# EAGLE design ARE_entrenadora_3 (EAGLE 5.10)
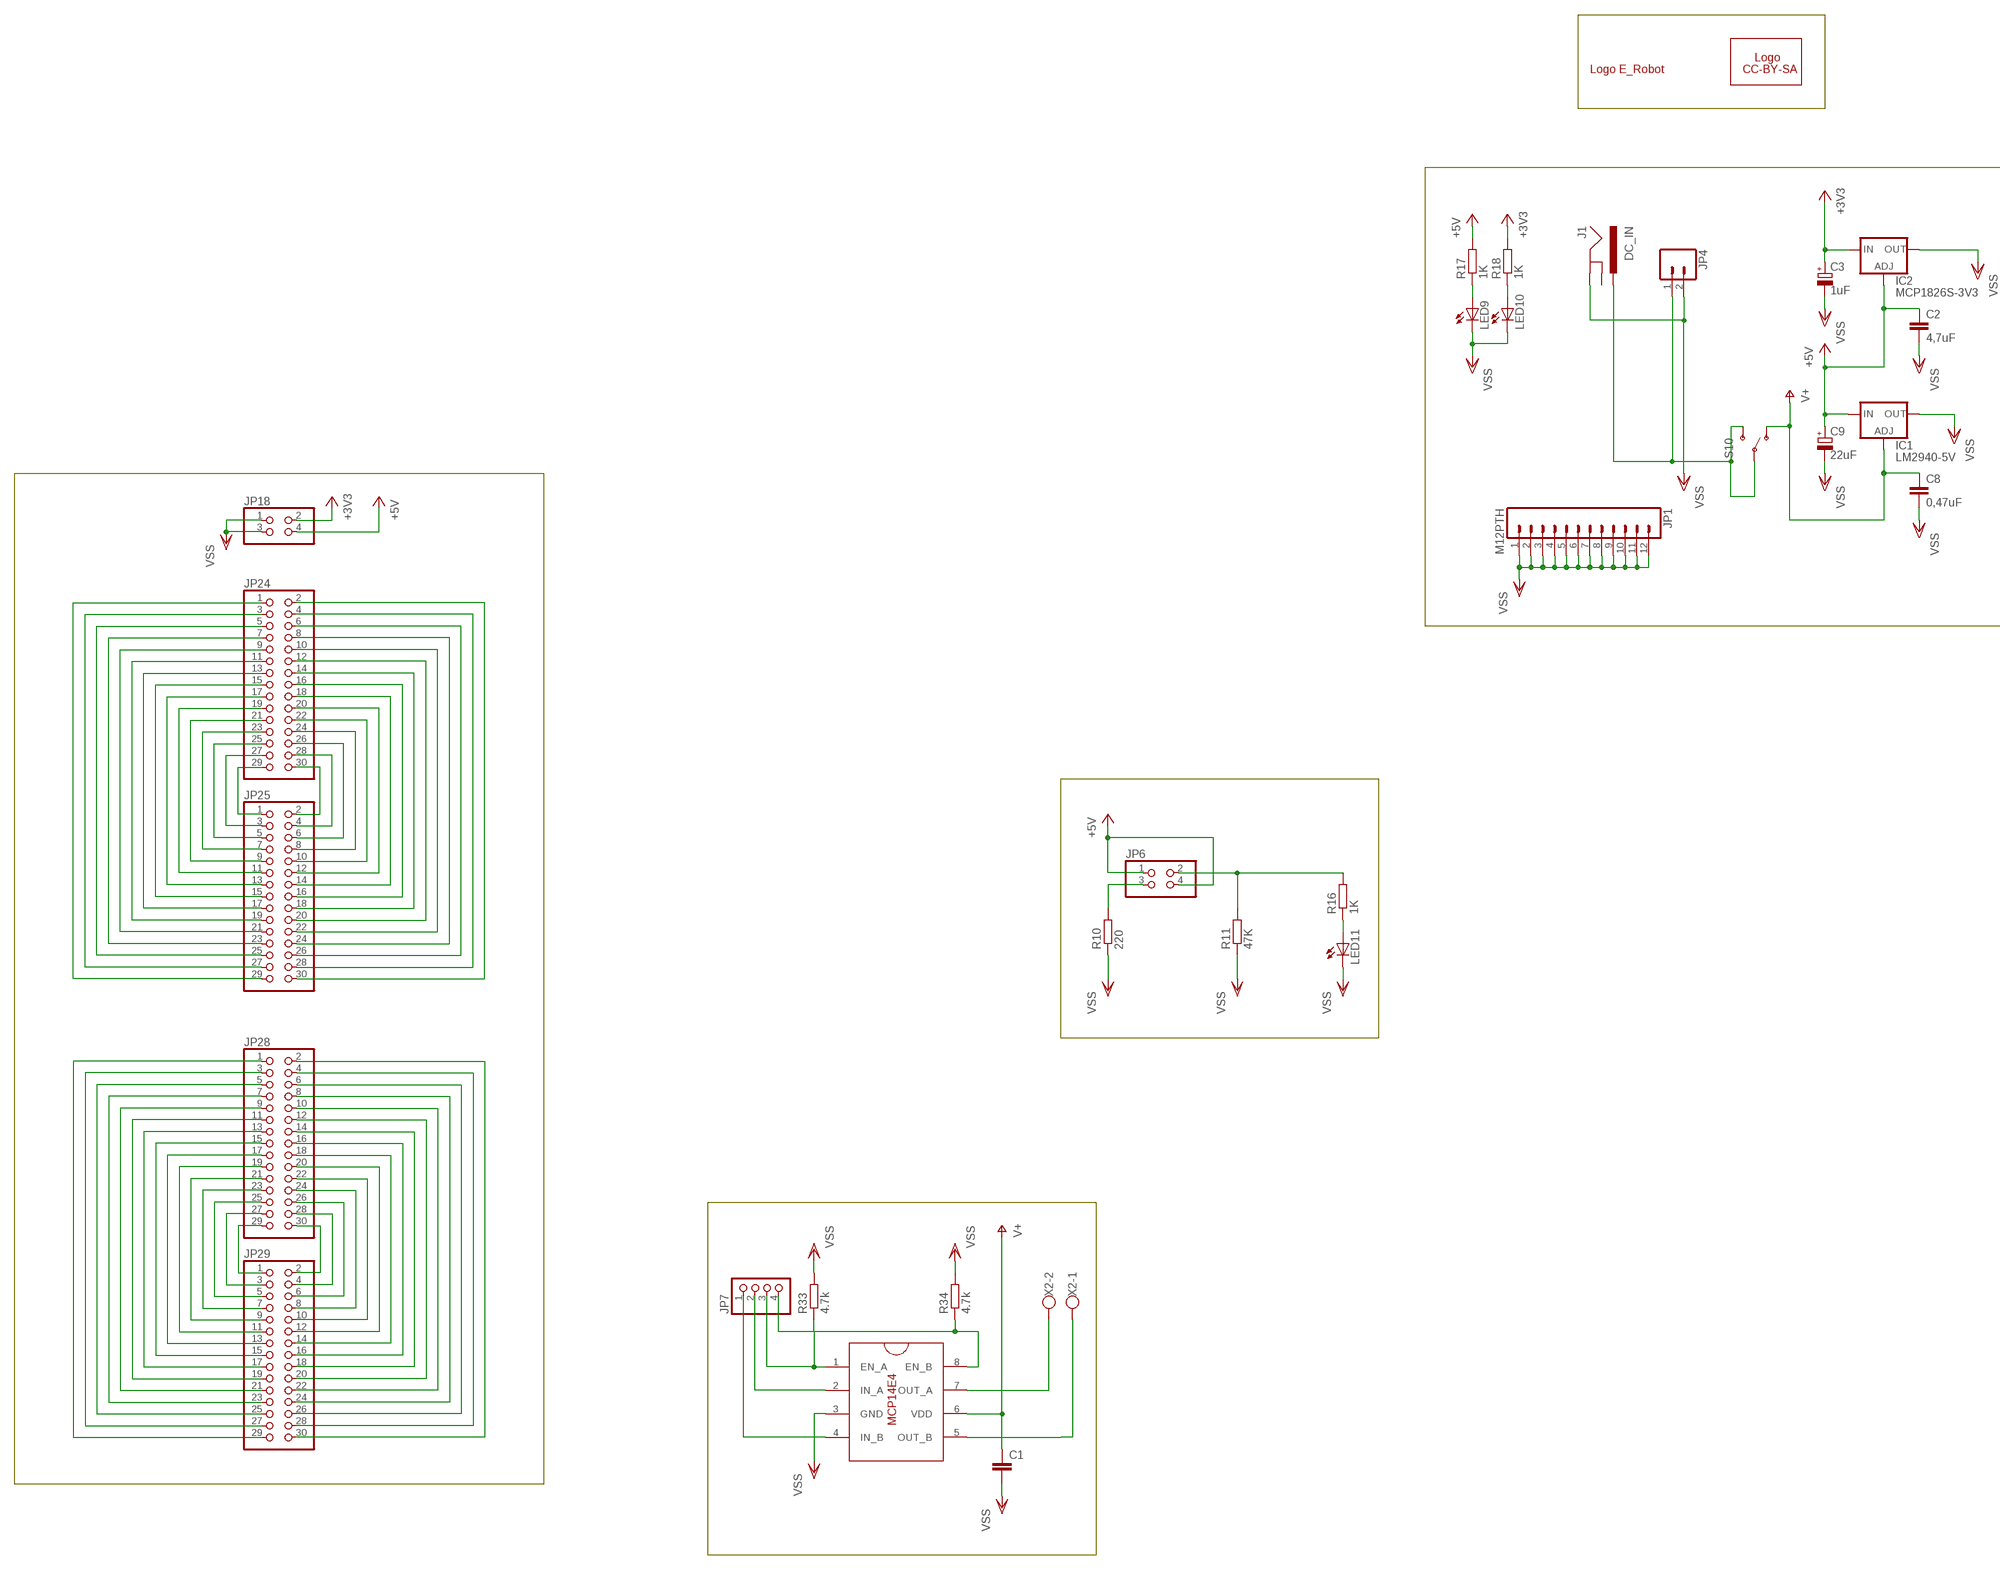
[diagram p0: schematic, sheet 1, part 1 of 2]
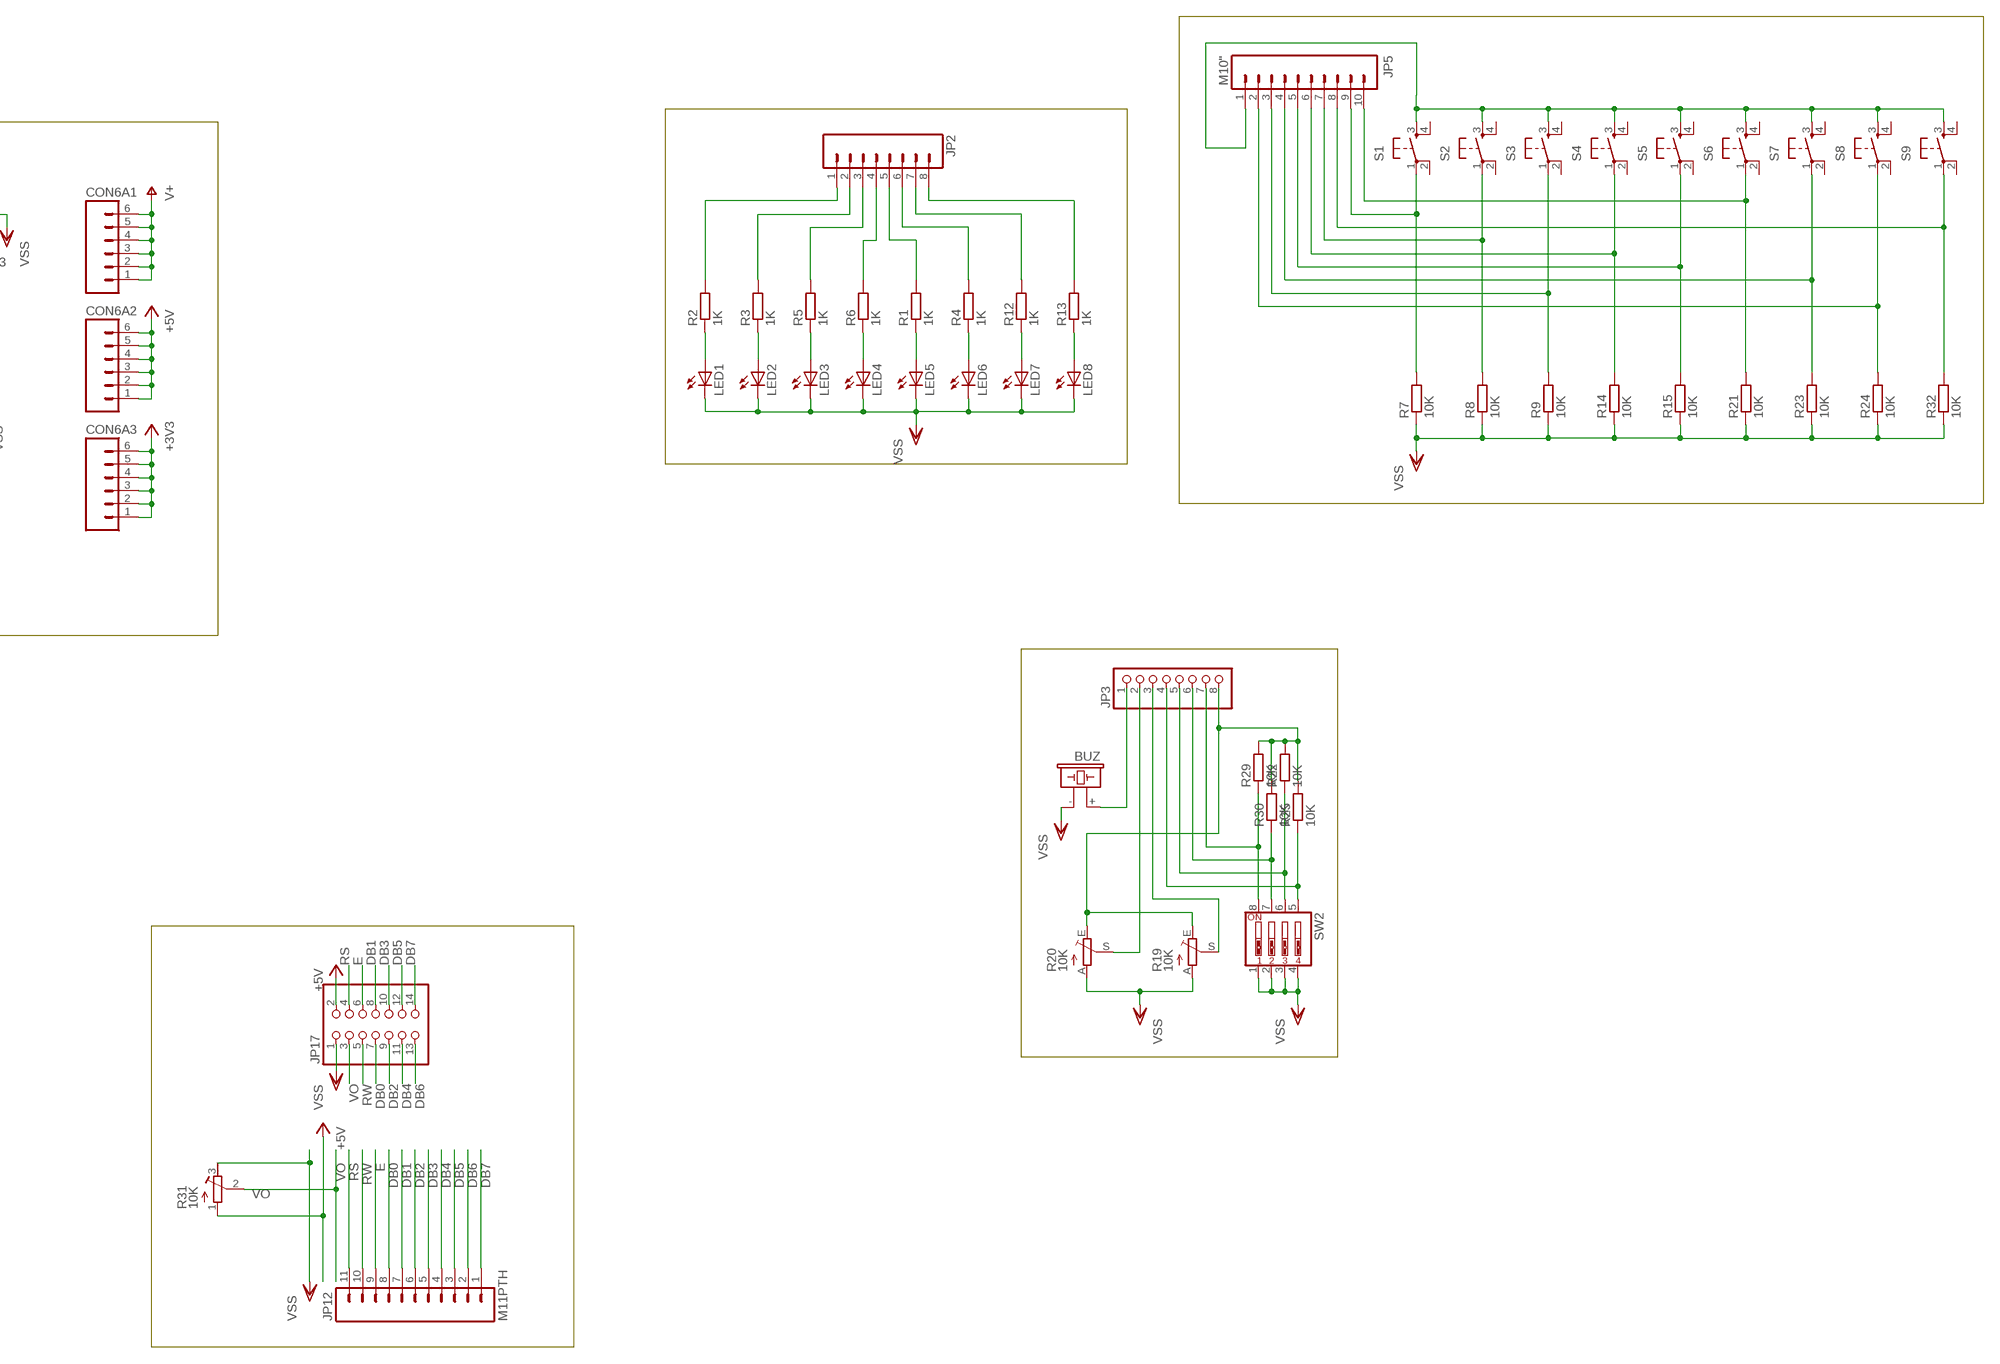
[diagram p1: schematic, sheet 1, part 2 of 2]

## Parts
BUZ  F/CM12P  [F/CM12P]
C1  C-EU050-025X075  [C050-025X075]
C2  4,7uF  C-EU025-025X050  [C025-025X050]
C3  1uF  CPOL-EUE2,5-6E  [E2,5-6E]
C8  0,47uF  C-EU025-025X050  [C025-025X050]
C9  22uF  CPOL-EUE2,5-6E  [E2,5-6E]
CON6A1  M06SIP  [1X06]
CON6A2  M06SIP  [1X06]
CON6A3  M06SIP  [1X06]
IC1  LM2940-5V  LM317BD2T  [D2PACK]
IC2  MCP1826S-3V3  LM317BD2T  [D2PACK]
J1  DC_IN  POWER_JACKPTH  [POWER_JACK_PTH]
JP1  M12PTH  [1X12]
JP2  M08  [1X08]
JP3  PINHD-1X8  [1X08]
JP4  M02PTH  [1X02]
JP5  M10"  [1X10]
JP6  PINHD-2X2  [2X02]
JP7  PINHD-1X4  [1X04]
JP12  M11PTH  [1X11]
JP17  PINHD-2X7  [2X07]
JP18  PINHD-2X2  [2X02]
JP24  PINHD-2X15  [2X15]
JP25  PINHD-2X15  [2X15]
JP28  PINHD-2X15  [2X15]
JP29  PINHD-2X15  [2X15]
LED1  LED3MM  [LED3MM]
LED2  LED3MM  [LED3MM]
LED3  LED3MM  [LED3MM]
LED4  LED3MM  [LED3MM]
LED5  LED3MM  [LED3MM]
LED6  LED3MM  [LED3MM]
LED7  LED3MM  [LED3MM]
LED8  LED3MM  [LED3MM]
LED9  LED3MM  [LED3MM]
LED10  LED3MM  [LED3MM]
LED11  LED3MM  [LED3MM]
R1  1K  R-EU_R0805  [R0805]
R2  1K  R-EU_R0805  [R0805]
R3  1K  R-EU_R0805  [R0805]
R4  1K  R-EU_R0805  [R0805]
R5  1K  R-EU_R0805  [R0805]
R6  1K  R-EU_R0805  [R0805]
R7  10K  R-EU_R0805  [R0805]
R8  10K  R-EU_R0805  [R0805]
R9  10K  R-EU_R0805  [R0805]
R10  220  R-EU_R0805  [R0805]
R11  47K  R-EU_R0805  [R0805]
R12  1K  R-EU_R0805  [R0805]
R13  1K  R-EU_R0805  [R0805]
R14  10K  R-EU_R0805  [R0805]
R15  10K  R-EU_R0805  [R0805]
R16  1K  R-EU_R0805  [R0805]
R17  1K  R-EU_R0805  [R0805]
R18  1K  R-EU_R0805  [R0805]
R19  10K  TRIM_EU-CA6V  [CA6V]
R20  10K  TRIM_EU-CA6V  [CA6V]
R21  10K  R-EU_R0805  [R0805]
R22  10K  R-EU_R0805  [R0805]
R23  10K  R-EU_R0805  [R0805]
R24  10K  R-EU_R0805  [R0805]
R25  10K  R-EU_R0805  [R0805]
R29  10K  R-EU_R0805  [R0805]
R30  10K  R-EU_R0805  [R0805]
R31  10K  R-TRIMM4G/J  [RTRIM4G/J]
R32  10K  R-EU_R0805  [R0805]
R33  4.7k  R-EU_R0805  [R0805]
R34  4.7k  R-EU_R0805  [R0805]
S1  TAC_SWITCHPTH  [TACTILE-PTH]
S2  TAC_SWITCHPTH  [TACTILE-PTH]
S3  TAC_SWITCHPTH  [TACTILE-PTH]
S4  TAC_SWITCHPTH  [TACTILE-PTH]
S5  TAC_SWITCHPTH  [TACTILE-PTH]
S6  TAC_SWITCHPTH  [TACTILE-PTH]
S7  TAC_SWITCHPTH  [TACTILE-PTH]
S8  TAC_SWITCHPTH  [TACTILE-PTH]
S9  TAC_SWITCHPTH  [TACTILE-PTH]
S10  SWITCH-SPSTSMD2  [SWITCH-SPDT-SMD]
SW2  SW_DIP-4  [EDG-04]
U$1  LOGO_BY-SA  [LOGO_CC-BY-SA]
U$5  LOGO_E_ROBOTGRANDE_BUTON  [GRANDE]
U$6  MCP14E4P  [DIL8]
X2  W237-102  [W237-102]

## Nets
+3V3: C3.+ CON6A3.1 CON6A3.2 CON6A3.3 CON6A3.4 CON6A3.5 CON6A3.6 IC2.3(IN) JP18.2 R18.2
+5V: C2.1 C9.+ CON6A2.1 CON6A2.2 CON6A2.3 CON6A2.4 CON6A2.5 CON6A2.6 IC1.3(IN) IC2.1(ADJ) JP6.1 JP6.4 JP17.2 JP18.4 R17.2 R31.1(E)
DB0: JP12.8 JP17.7
DB1: JP12.7 JP17.8
DB2: JP12.6 JP17.9
DB3: JP12.5 JP17.10
DB4: JP12.4 JP17.11
DB5: JP12.3 JP17.12
DB6: JP12.2 JP17.13
DB7: JP12.1 JP17.14
E: JP12.9 JP17.6
N$1: LED3.A R5.1
N$2: LED2.A R3.1
N$3: LED1.A R2.1
N$4: LED4.A R6.1
N$5: JP2.2 R3.2
N$6: JP2.3 R5.2
N$7: JP2.1 R2.2
N$8: JP2.4 R6.2
N$9: LED9.A R17.1
N$10: JP5.9 R7.2 S1.1
N$11: JP5.7 R8.2 S2.1
N$12: JP5.6 R14.2 S4.1
N$13: JP3.8 R19.E R20.E R22.2 R25.2 R29.2 R30.2
N$14: JP6.3 R10.2
N$15: BUZ.+ JP3.1
N$16: JP3.7 R29.1 SW2.8
N$17: JP6.2 R11.2 R16.2
N$18: LED10.A R18.1
N$19: JP5.10 R21.2 S6.1
N$20: JP5.4 R23.2 S7.1
N$21: LED11.A R16.1
N$22: JP3.6 R30.1 SW2.7
N$23: JP3.5 R22.1 SW2.6
N$24: JP3.4 R25.1 SW2.5
N$25: JP5.2 R24.2 S8.1
N$26: JP5.1 S1.3 S2.3 S3.3 S4.3 S5.3 S6.3 S7.3 S8.3 S9.3
N$30: JP28.29 JP29.1
N$31: JP28.27 JP29.3
N$32: JP28.25 JP29.5
N$33: JP28.23 JP29.7
N$34: JP28.21 JP29.9
N$35: JP28.19 JP29.11
N$36: JP28.17 JP29.13
N$37: JP28.15 JP29.15
N$38: JP28.13 JP29.17
N$39: JP28.11 JP29.19
N$40: JP28.9 JP29.21
N$41: JP28.7 JP29.23
N$42: JP28.5 JP29.25
N$43: JP28.3 JP29.27
N$44: JP5.8 R32.2 S9.1
N$45: J1.PWR JP4.1 S10.2(P) S10.3(S)
N$46: JP28.30 JP29.2
N$47: JP28.28 JP29.4
N$48: JP28.26 JP29.6
N$49: JP28.24 JP29.8
N$50: U$6.7(OUT_A) X2.2
N$51: JP5.3 R9.2 S3.1
N$52: U$6.5(OUT_B) X2.1
N$53: JP3.2 R20.S
N$54: JP3.3 R19.S
N$56: JP7.3 R33.1 U$6.1(EN_A)
N$58: LED6.A R4.1
N$59: LED5.A R1.1
N$60: LED7.A R12.1
N$61: LED8.A R13.1
N$62: JP2.6 R4.2
N$63: JP2.7 R12.2
N$64: JP2.5 R1.2
N$65: JP2.8 R13.2
N$66: JP5.5 R15.2 S5.1
N$67: JP7.2 U$6.2(IN_A)
N$71: JP28.1 JP29.29
N$72: JP28.2 JP29.30
N$73: JP7.1 U$6.4(IN_B)
N$75: JP7.4 R34.1 U$6.8(EN_B)
N$82: JP28.22 JP29.10
N$85: JP28.20 JP29.12
N$86: JP28.18 JP29.14
N$87: JP28.16 JP29.16
N$88: JP28.14 JP29.18
N$89: JP28.12 JP29.20
N$90: JP28.10 JP29.22
N$91: JP28.8 JP29.24
N$92: JP28.6 JP29.26
N$93: JP28.4 JP29.28
N$96: JP24.30 JP25.2
N$97: JP24.28 JP25.4
N$98: JP24.26 JP25.6
N$99: JP24.24 JP25.8
N$100: JP24.22 JP25.10
N$101: JP24.20 JP25.12
N$102: JP24.18 JP25.14
N$103: JP24.16 JP25.16
N$104: JP24.14 JP25.18
N$105: JP24.12 JP25.20
N$106: JP24.10 JP25.22
N$107: JP24.8 JP25.24
N$108: JP24.6 JP25.26
N$109: JP24.4 JP25.28
N$110: JP24.2 JP25.30
N$112: JP24.29 JP25.1
N$113: JP24.27 JP25.3
N$114: JP24.25 JP25.5
N$115: JP24.23 JP25.7
N$116: JP24.21 JP25.9
N$117: JP24.19 JP25.11
N$118: JP24.17 JP25.13
N$119: JP24.15 JP25.15
N$120: JP24.13 JP25.17
N$121: JP24.11 JP25.19
N$122: JP24.9 JP25.21
N$123: JP24.7 JP25.23
N$124: JP24.5 JP25.25
N$125: JP24.3 JP25.27
N$126: JP24.1 JP25.29
RS: JP12.11 JP17.4
RW: JP12.10 JP17.5
V+: C1.1 C8.1 CON6A1.1 CON6A1.2 CON6A1.3 CON6A1.4 CON6A1.5 CON6A1.6 IC1.1(ADJ) S10.1(O) U$6.6(VDD)
VO: JP17.3 R31.2(S)
VSS: BUZ.- C1.2 C2.2 C3.- C8.2 C9.- IC1.2(OUT) IC2.2(OUT) J1.GND JP1.1 JP1.2 JP1.3 JP1.4 JP1.5 JP1.6 JP1.7 JP1.8 JP1.9 JP1.10 JP1.11 JP1.12 JP4.2 JP17.1 JP18.1 JP18.3 LED1.K(C) LED2.K(C) LED3.K(C) LED4.K(C) LED5.K(C) LED6.K(C) LED7.K(C) LED8.K(C) LED9.K(C) LED10.K(C) LED11.K(C) R7.1 R8.1 R9.1 R10.1 R11.1 R14.1 R15.1 R19.A R20.A R21.1 R23.1 R24.1 R31.3(A) R32.1 R33.2 R34.2 SW2.1 SW2.2 SW2.3 SW2.4 U$6.3(GND)
Unconnected: J1.GNDBREAK S1.2 S1.4 S2.2 S2.4 S3.2 S3.4 S4.2 S4.4 S5.2 S5.4 S6.2 S6.4 S7.2 S7.4 S8.2 S8.4 S9.2 S9.4

## Library data of the parts
BUZ = buzzer:F/CM12P: BUZZER Source: Buerklin
C1 C2 C8 = rcl:C-EU: CAPACITOR, European symbol
C3 C9 = rcl:CPOL-EU: POLARIZED CAPACITOR, European symbol
CON6A1-CON6A3 = SparkFun:M06: Header 6 Standard 6-pin 0.1" header. Use with straight break away headers (SKU : PRT-00116), right angle break away headers (PRT-00553), swiss pins (PRT-00743), machine pins (PRT-00117), and female headers (PRT-00115). Molex polarized connector foot print use with SKU : PRT-08094 with associated crimp pins and housings. NOTES ON THE VARIANTS LOCK and LOCK_LONGPADS... This footprint was designed to help hold the alignment of a through-hole component (i.e. 6-pin header) while soldering it into place. You may notice that each hole has been shifted either up or down by 0.005 of an inch from it's more standard position (which is a perfectly straight line). This slight alteration caused the pins (the squares in the middle) to touch the edges of the holes. Because they are alternating, it causes a "brace" to hold the component in place. 0.005 has proven to be the perfect amount of "off-center" position when using our standard breakaway headers. Although looks a little odd when you look at the bare footprint, once you have a header in there, the alteration is very hard to notice. Also, if you push a header all the way into place, it is covered up entirely on the bottom side. This idea of altering the position of holes to aid alignment will be further integrated into the Sparkfun Library for other footprints. It can help hold any component with 3 or more connection pins.
IC1 IC2 = v-reg:LM317?*: 500 mA Adjustable Output Positive Voltage Regulator Source: http://www.onsemi.co.jp .. LM317M-D.PDF
J1 = SparkFun:POWER_JACK: Power Jack This is the standard 5.5mm barrel jack for power. The PTH is the most common, proven, reliable, footprint. All others are experimental. The Slot footprint only works if the mill layer is transmitted to the PCB fab house so be warned. Spark Fun Electronics SKU : PRT-00119. Mating wall wart : TOL-00298 (and others)
JP1 = SparkFun:M12: Header 12 Standard 12-pin 0.1" header. Use with straight break away headers (SKU : PRT-00116), right angle break away headers (PRT-00553), swiss pins (PRT-00743), machine pins (PRT-00117), and female headers (PRT-00115).
JP2 = SparkFun:M08: Header 8 Standard 8-pin 0.1" header. Use with straight break away headers (SKU : PRT-00116), right angle break away headers (PRT-00553), swiss pins (PRT-00743), machine pins (PRT-00117), and female headers (PRT-00115).
JP3 = pinhead:PINHD-1X8: PIN HEADER
JP4 = SparkFun:M02: Header 2 Standard 2-pin 0.1" header. Use with straight break away headers (SKU : PRT-00116), right angle break away headers (PRT-00553), swiss pins (PRT-00743), machine pins (PRT-00117), and female headers (PRT-00115). Molex polarized connector foot print use with SKU : PRT-08233 with associated crimp pins and housings.
JP5 = SparkFun:M10: Header 10 Standard 10-pin 0.1" header. Use with straight break away headers (SKU : PRT-00116), right angle break away headers (PRT-00553), swiss pins (PRT-00743), machine pins (PRT-00117), and female headers (PRT-00115).
JP6 JP18 = pinhead:PINHD-2X2: PIN HEADER
JP7 = pinhead:PINHD-1X4: PIN HEADER
JP12 = SparkFun:M11: Header 11 Standard 11-pin 0.1" header. Use with straight break away headers (SKU : PRT-00116), right angle break away headers (PRT-00553), swiss pins (PRT-00743), machine pins (PRT-00117), and female headers (PRT-00115).
JP17 = pinhead:PINHD-2X7: PIN HEADER
JP24 JP25 JP28 JP29 = pinhead:PINHD-2X15: PIN HEADER
LED1-LED8 = led:LED: LED OSRAM: - CHIPLED LG R971, LG N971, LY N971, LG Q971, LY Q971, LO R971, LY R971 LH N974, LH R974 LS Q976, LO Q976, LY Q976 LO Q996 - Hyper CHIPLED LW Q18S LB Q993, LB Q99A, LB R99A - SideLED LS A670, LO A670, LY A670, LG A670, LP A670 LB A673, LV A673, LT A673, LW A673 LH A674 LY A675 LS A676, LA A676, LO A676, LY A676, LW A676 LS A679, LY A679, LG A679 - Hyper Micro SIDELED® LS Y876, LA Y876, LO Y876, LY Y876 LT Y87S - SmartLED LW L88C, LW L88S LB L89C, LB L89S, LG L890 LS L89K, LO L89K, LY L89K LS L896, LA L896, LO L896, LY L896 - TOPLED LS T670, LO T670, LY T670, LG T670, LP T670 LSG T670, LSP T670, LSY T670, LOP T670, LYG T670 LG T671, LOG T671, LSG T671 LB T673, LV T673, LT T673, LW T673 LH T674 LS T676, LA T676, LO T676, LY T676, LB T676, LH T676, LSB T676, LW T676 LB T67C, LV T67C, LT T67C, LS T67K, LO T67K, LY T67K, LW E67C LS E67B, LA E67B, LO E67B, LY E67B, LB E67C, LV E67C, LT E67C LW T67C LS T679, LY T679, LG T679 LS T770, LO T770, LY T770, LG T770, LP T770 LB T773, LV T773, LT T773, LW T773 LH T774 LS E675, LA E675, LY E675, LS T675 LS T776, LA T776, LO T776, LY T776, LB T776 LHGB T686 LT T68C, LB T68C - Hyper Mini TOPLED® LB M676 - Mini TOPLED Santana® LG M470 LS M47K, LO M47K, LY M47K Source: http://www.osram.convergy.de LUXEON: - LUMILED® LXK2-PW12-R00, LXK2-PW12-S00, LXK2-PW14-U00, LXK2-PW14-V00 LXK2-PM12-R00, LXK2-PM12-S00, LXK2-PM14-U00 LXK2-PE12-Q00, LXK2-PE12-R00, LXK2-PE12-S00, LXK2-PE14-T00, LXK2-PE14-U00 LXK2-PB12-K00, LXK2-PB12-L00, LXK2-PB12-M00, LXK2-PB14-N00, LXK2-PB14-P00, LXK2-PB14-Q00 LXK2-PR12-L00, LXK2-PR12-M00, LXK2-PR14-Q00, LXK2-PR14-R00 LXK2-PD12-Q00, LXK2-PD12-R00, LXK2-PD12-S00 LXK2-PH12-R00, LXK2-PH12-S00 LXK2-PL12-P00, LXK2-PL12-Q00, LXK2-PL12-R00 Source: www.luxeon.com KINGBRIGHT: KA-3528ASYC Source: www.kingbright.com
LED9-LED11 = SparkFun:LED: LEDs Standard schematic elements and footprints for 5mm, 3mm, 1206, and 0603 sized LEDs. 5mm - Spark Fun Electronics SKU : COM-00529 (and others)
R1-R18 R21-R25 R29 R30 R32-R34 = rcl:R-EU_: RESISTOR, European symbol
R19 R20 = pot:TRIM_EU-: POTENTIOMETER
R31 = resistor:R-TRIMM: Trimm resistor
S1-S9 = SparkFun:TAC_SWITCH: Momentary Switch Button commonly used for reset or general input. Spark Fun Electronics SKU : COM-00097
S10 = SparkFun:SWITCH-SPST: SPST Switch Simple slide switch. Spark Fun Electronics SKU : COM-00102
SW2 = special:SW_DIP-4: DIP SWITCH
U$1 = ARE_logos:LOGO_BY-SA
U$5 = Logos:LOGO_E_ROBOT
U$6 = microchip_nuevo:MCP14E4
X2 = con-wago-500:W237-102: WAGO SCREW CLAMP

## Board
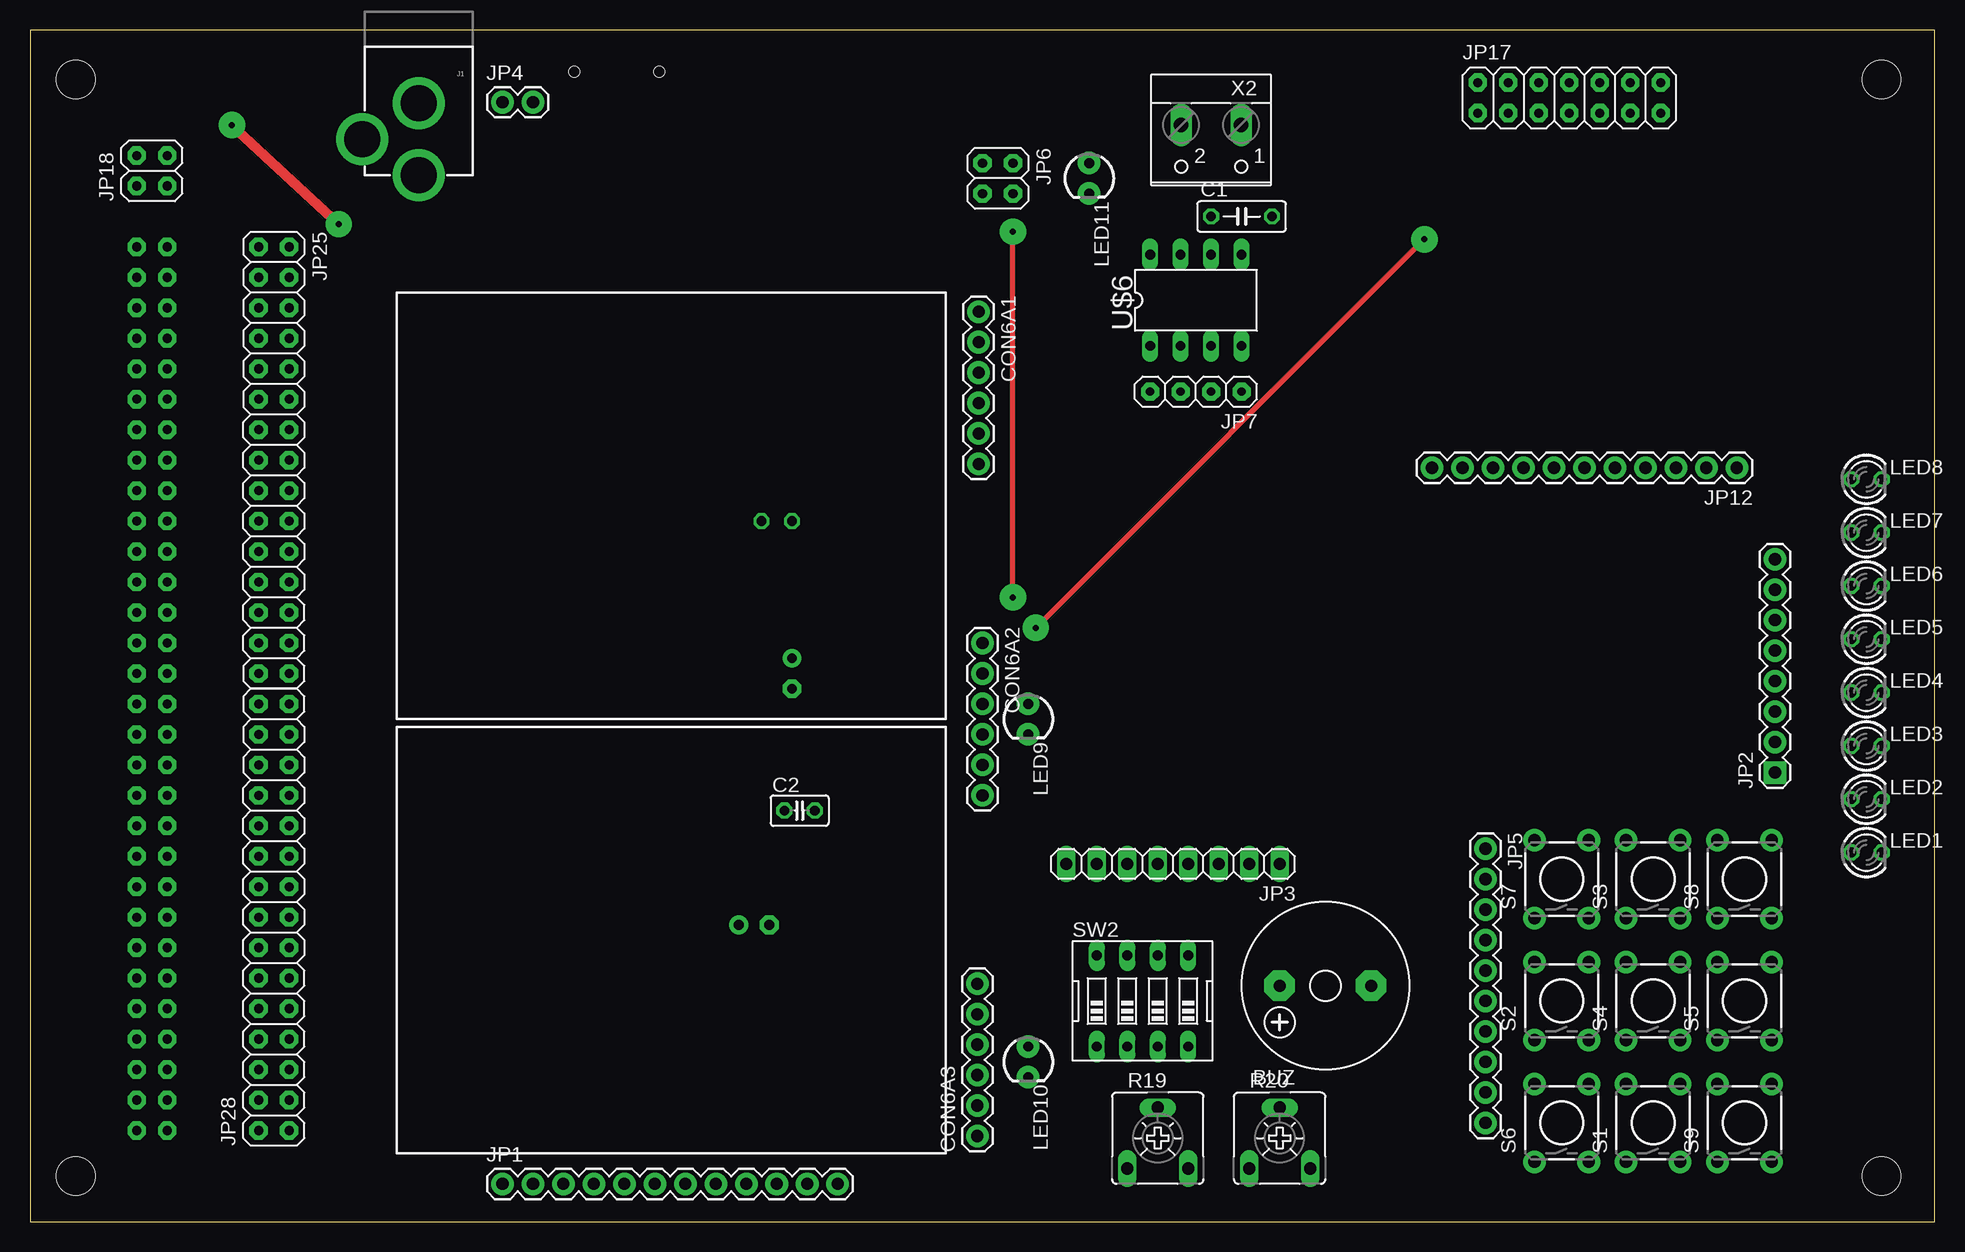
[diagram p2: board, top side]
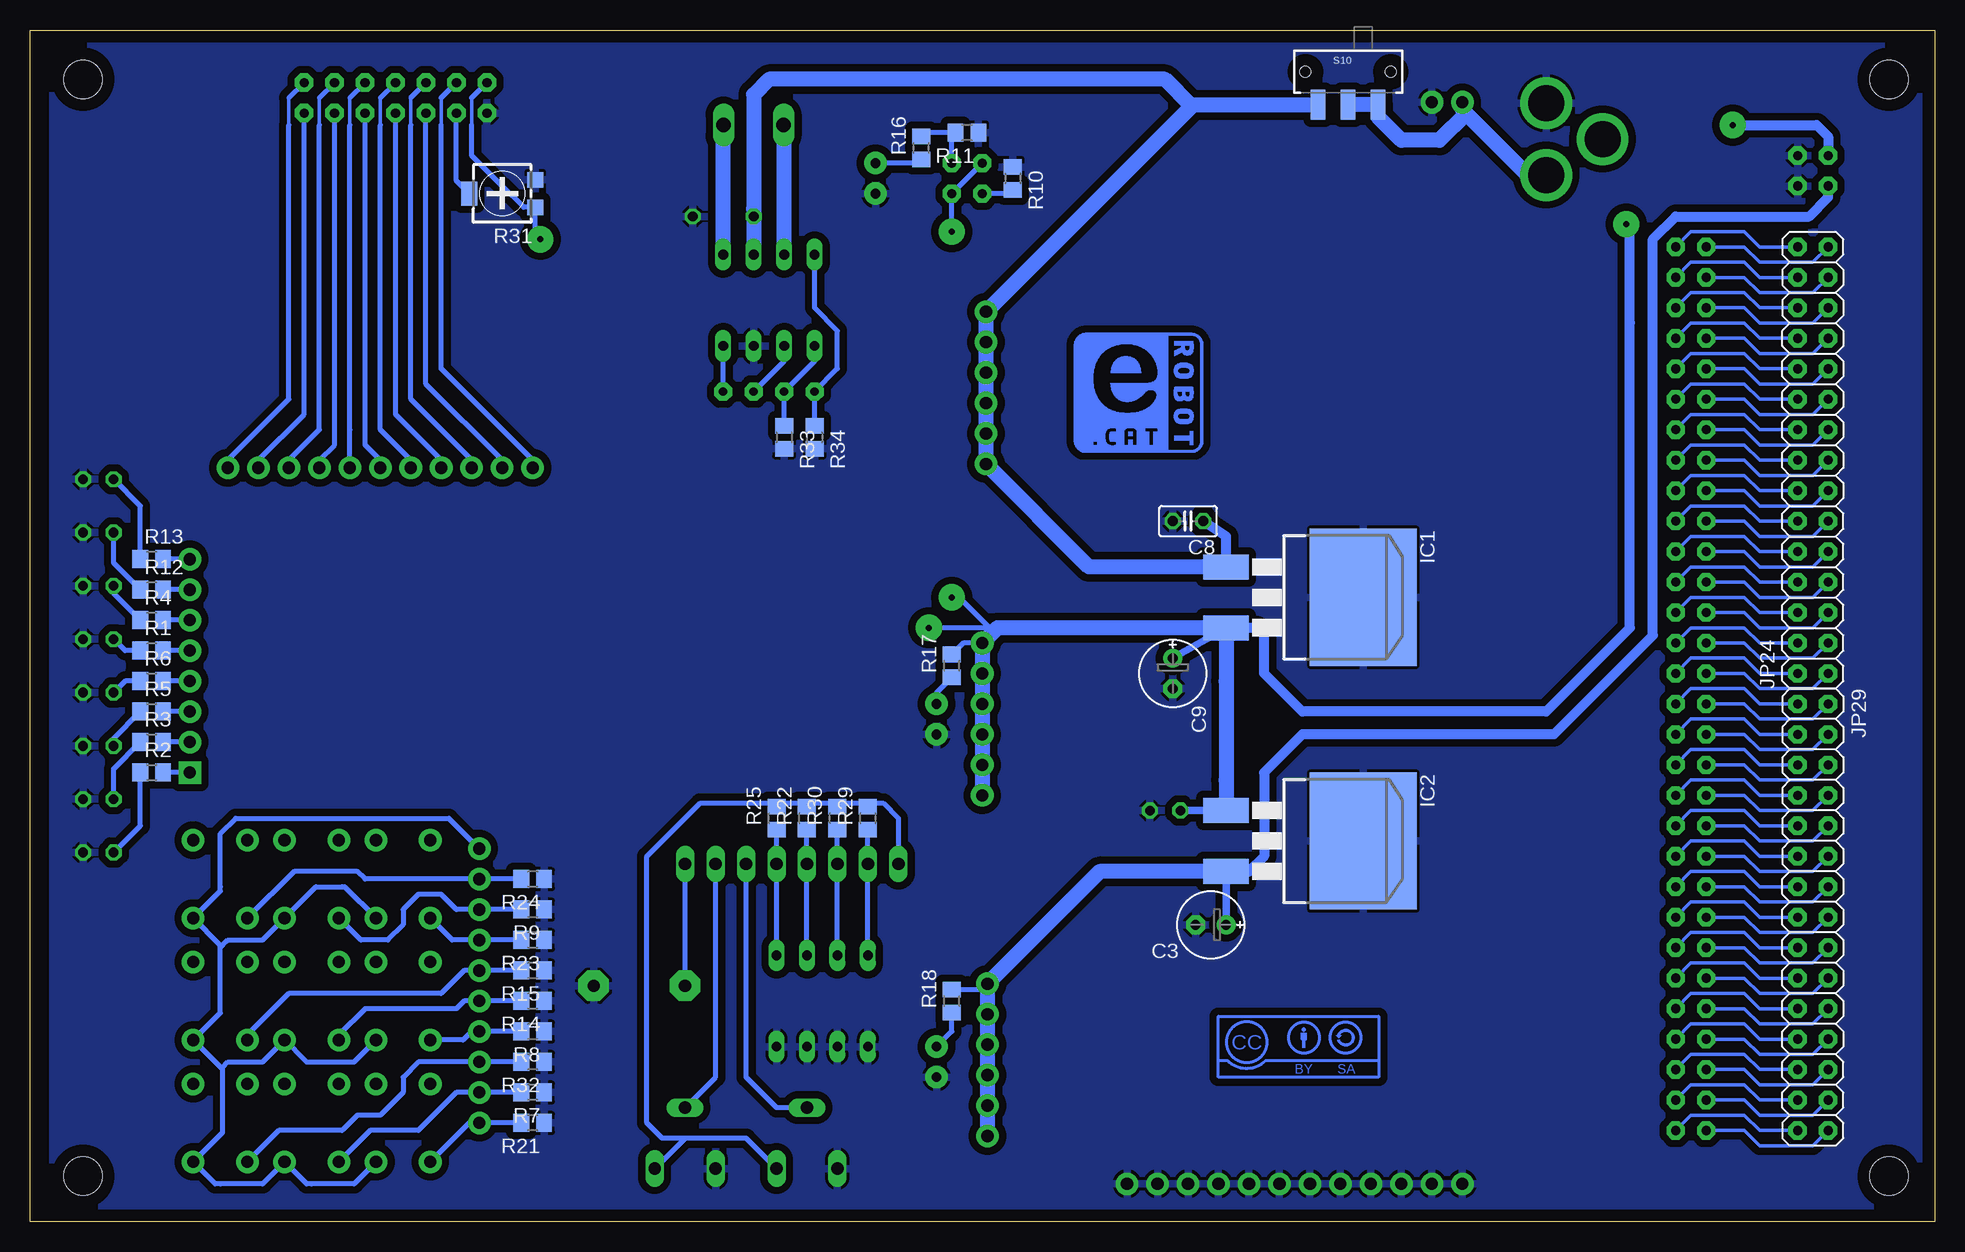
[diagram p3: board, bottom side, seen from below]

Size 158.73 x 99.36 mm. Coordinates in mm from the lower left corner, seen from the top.
Outline: 0,0 158.73,0 158.73,99.36 0,99.36 0,0
Copper layers (1*16): Top 0.035mm / dielectric 1.5mm / Bottom 0.035mm
Design rules "default": minimum track width 10mil, minimum drill 24mil, track to track 8mil, track to pad 8mil, pad to pad 8mil, via to via 8mil, smd to smd 8mil, copper to edge 40mil, drill to drill 8mil, minimum pad ring 10mil, minimum via ring 8mil, stop-mask expansion 4mil, vias tented up to drill 0mil, thermal gap 10mil
Holes 3.2 mm at 154.31,3.81 3.81,3.81 3.81,95.25 154.31,95.25

### Footprints (pad centres in the part's own frame; a part is rotated, then mirrored left to right if it is on the bottom)
F/CM12P = drill 1.016 pad 2.54 octagon: + 3.81,0; - -3.81,0
C050-025X075 = drill 0.813 octagon: 1 -2.54,0; 2 2.54,0
C025-025X050 = drill 0.813 octagon: 1 -1.27,0; 2 1.27,0
E2,5-6E = drill 0.813 pad 1.575 round: + -1.27,0 | drill 0.813 pad 1.575 octagon: - 1.27,0
1X06 = drill 1.016 pad 1.88 round: 1 0,0; 2 2.54,0; 3 5.08,0; 4 7.62,0; 5 10.16,0; 6 12.7,0
D2PACK = smd 2.083 x 3.81: 1 -2.54,-8.89; 3 2.54,-8.89 | smd 11.43 x 8.89: 2 0,2.54
POWER_JACK_PTH = drill 2.997 pad 4.318 round: GND 0,7.7; GNDBREAK 4.7,10.7; PWR 0,13.7
1X12 = drill 1.016 pad 1.88 round: 1 0,0; 2 2.54,0; 3 5.08,0; 4 7.62,0; 5 10.16,0; 6 12.7,0; 7 15.24,0; 8 17.78,0; 9 20.32,0; 10 22.86,0; 11 25.4,0; 12 27.94,0
1X08 = drill 1.016 pad 1.88 square: 1 0,0 | drill 1.016 pad 1.88 round: 2 2.54,0; 3 5.08,0; 4 7.62,0; 5 10.16,0; 6 12.7,0; 7 15.24,0; 8 17.78,0
1X08' = drill 1.016 long: 1 -8.89,0; 2 -6.35,0; 3 -3.81,0; 4 -1.27,0; 5 1.27,0; 6 3.81,0; 7 6.35,0; 8 8.89,0
1X02 = drill 1.016 pad 1.88 round: 1 0,0; 2 2.54,0
1X10 = drill 1.016 pad 1.88 round: 1 0,0; 2 2.54,0; 3 5.08,0; 4 7.62,0; 5 10.16,0; 6 12.7,0; 7 15.24,0; 8 17.78,0; 9 20.32,0; 10 22.86,0
2X02 = drill 0.762 pad 1.524 octagon: 1 -1.27,-1.27; 2 -1.27,1.27; 3 1.27,-1.27; 4 1.27,1.27
1X04 = drill 0.7 pad 1.5 octagon: 1 -3.81,0; 2 -1.27,0; 3 1.27,0; 4 3.81,0
1X11 = drill 1.016 pad 1.88 round: 1 0,0; 2 2.54,0; 3 5.08,0; 4 7.62,0; 5 10.16,0; 6 12.7,0; 7 15.24,0; 8 17.78,0; 9 20.32,0; 10 22.86,0; 11 25.4,0
2X07 = drill 0.762 pad 1.524 octagon: 1 -7.62,-1.27; 2 -7.62,1.27; 3 -5.08,-1.27; 4 -5.08,1.27; 5 -2.54,-1.27; 6 -2.54,1.27; 7 0,-1.27; 8 0,1.27; 9 2.54,-1.27; 10 2.54,1.27; 11 5.08,-1.27; 12 5.08,1.27; 13 7.62,-1.27; 14 7.62,1.27
2X15 = drill 0.762 pad 1.524 octagon: 1 -17.78,-1.27; 2 -17.78,1.27; 3 -15.24,-1.27; 4 -15.24,1.27; 5 -12.7,-1.27; 6 -12.7,1.27; 7 -10.16,-1.27; 8 -10.16,1.27; 9 -7.62,-1.27; 10 -7.62,1.27; 11 -5.08,-1.27; 12 -5.08,1.27; 13 -2.54,-1.27; 14 -2.54,1.27; 15 0,-1.27; 16 0,1.27; 17 2.54,-1.27; 18 2.54,1.27; 19 5.08,-1.27; 20 5.08,1.27; 21 7.62,-1.27; 22 7.62,1.27; 23 10.16,-1.27; 24 10.16,1.27; 25 12.7,-1.27; 26 12.7,1.27; 27 15.24,-1.27; 28 15.24,1.27; 29 17.78,-1.27; 30 17.78,1.27
LED3MM = drill 0.813 octagon: A -1.27,0; K 1.27,0
LED3MM' = drill 0.813 pad 1.88 round: A -1.27,0; K 1.27,0
R0805 = smd 1.3 x 1.5: 1 -0.95,0; 2 0.95,0
CA6V = drill 1.016 long: A -2.54,-2.54; E 2.54,-2.54; S 0,2.54
RTRIM4G/J = smd 1.3 x 1.3: 1 -1.15,-2.75; 3 1.15,-2.75 | smd 2 x 1.3: 2 0,2.75
TACTILE-PTH = drill 1.016 pad 1.88 round: 1 -3.251,2.261; 2 3.251,2.261; 3 -3.251,-2.261; 4 3.251,-2.261
SWITCH-SPDT-SMD = smd 1.2 x 2.5: 1 -2.5,-2.75; 2 0,-2.75; 3 2.5,-2.75 | hole 0.9: -3.55,0; 3.55,0
EDG-04 = drill 0.813 long: 1 -3.81,-3.81; 2 -1.27,-3.81; 3 1.27,-3.81; 4 3.81,-3.81; 5 3.81,3.81; 6 1.27,3.81; 7 -1.27,3.81; 8 -3.81,3.81
DIL8 = drill 0.813 long: 1 -3.81,-3.81; 2 -1.27,-3.81; 3 1.27,-3.81; 4 3.81,-3.81; 5 3.81,3.81; 6 1.27,3.81; 7 -1.27,3.81; 8 -3.81,3.81
W237-102 = drill 1.194 long: 1 -2.5,-1.27; 2 2.5,-1.27

### Placement (x,y rotation side)
BUZ  107.95,19.68 180 top
C1  100.97,83.82 0 top
C2  64.14,34.29 0 top
C3  60.33,24.77 180 bottom
C8  62.23,58.42 180 bottom
C9  63.5,45.72 270 bottom
CON6A1  79.06,75.88 270 top
CON6A2  79.38,48.26 270 top
CON6A3  78.94,7.16 90 top
IC1  50.16,52.07 270 bottom
IC2  50.16,31.75 270 bottom
J1  32.38,100.97 180 top
JP1  39.37,3.17 0 top
JP2  145.41,37.47 90 top
JP3  [1X08']  95.25,29.84 180 top
JP4  39.37,93.34 0 top
JP5  121.28,31.11 270 top
JP6  80.64,87 270 top
JP7  97.16,69.22 180 top
JP12  142.24,62.87 180 top
JP17  128.27,93.71 0 top
JP18  10.16,87.63 90 top
JP24  10.16,63.5 90 bottom
JP25  20.32,63.5 270 top
JP28  20.32,25.4 90 top
JP29  10.16,25.4 270 bottom
LED1  153.03,30.8 0 top
LED2  153.03,35.24 0 top
LED3  153.03,39.69 0 top
LED4  153.03,44.13 0 top
LED5  153.03,48.58 0 top
LED6  153.03,53.02 0 top
LED7  153.03,57.47 0 top
LED8  153.03,61.91 0 top
LED9  [LED3MM']  83.19,41.91 270 top
LED10  [LED3MM']  83.19,13.34 270 top
LED11  [LED3MM']  88.27,87 270 top
R1  148.59,47.62 0 bottom
R2  148.59,37.47 0 bottom
R3  148.59,40.01 0 bottom
R4  148.59,50.16 0 bottom
R5  148.59,42.55 0 bottom
R6  148.59,45.09 0 bottom
R7  116.84,10.79 180 bottom
R8  116.84,15.88 180 bottom
R9  116.84,26.04 180 bottom
R10  76.83,87 270 bottom
R11  80.64,90.81 180 bottom
R12  148.59,52.7 0 bottom
R13  148.59,55.24 0 bottom
R14  116.84,18.41 180 bottom
R15  116.84,20.95 180 bottom
R16  84.45,89.53 90 bottom
R17  81.92,46.35 90 bottom
R18  81.92,18.41 90 bottom
R19  93.98,6.99 0 top
R20  104.14,6.99 0 top
R21  116.84,8.26 180 bottom
R22  93.98,33.66 90 bottom
R23  116.84,23.5 180 bottom
R24  116.84,28.57 180 bottom
R25  96.52,33.66 90 bottom
R29  88.9,33.66 90 bottom
R30  91.44,33.66 90 bottom
R31  119.38,85.72 90 bottom
R32  116.84,13.34 180 bottom
R33  95.89,65.41 270 bottom
R34  93.34,65.41 270 bottom
S1  135.25,8.26 90 top
S2  127.64,18.41 90 top
S3  135.25,28.57 90 top
S4  135.25,18.41 90 top
S5  142.88,18.41 90 top
S6  127.64,8.26 90 top
S7  127.64,28.57 90 top
S8  142.88,28.57 90 top
S9  142.88,8.26 90 top
S10  48.9,95.89 0 bottom
SW2  92.71,18.41 0 top
U$1  59.69,12.06 0 bottom
U$2  BREADBOARDMINI  [BREADBOARD-MINI]  30.57,41.91 0 top
U$3  BREADBOARDMINI  [BREADBOARD-MINI]  30.57,5.71 0 top
U$5  60.96,64.14 0 top
U$6  97.16,76.83 0 top
X2  98.42,90.17 180 top

### Tracks (layer width: path | path; a pad name or v marks a point on that pad's centre or on a via)
+3V3
  Bottom 0.406: R18.2 79.43,19.36 CON6A3.6
  Bottom 0.61: IC2.3 C3.+
  Bottom 0.813: JP18.2 8.89,85.41 10.48,83.82 21.59,83.82 23.5,81.92 23.5,48.9 31.75,40.64 52.7,40.64 55.88,37.47 55.88,30.48 57.15,29.21 IC2.3
  Bottom 1.27: CON6A3.1 CON6A3.2 CON6A3.3 78.94,13.65 CON6A3.4 CON6A3.5 78.94,18.41 CON6A3.6 69.59,29.21 IC2.3
+5V  (via drill 0.5 pad 2.18)
  Top 0.406: v83.82,49.53 v116.2,81.92 | v81.92,52.07 v81.92,82.55
  Top 0.813: v25.72,83.19 v16.83,91.44
  Bottom 0.305: 121.92,91.44 121.92,93.71
  Bottom 0.406: 121.92,93.71 JP17.2 | 121.92,91.44 121.92,88.9 119.38,86.36 117.59,84.58 R31.1 116.63,82.34 v116.2,81.92 | R17.2 80.96,48.26 CON6A2.1 | 78.11,49.53 78.74,49.53 | 78.74,49.53 v83.82,49.53 | JP6.1 JP6.4 v81.92,82.55 | 78.74,49.53 81.28,52.07 v81.92,52.07
  Bottom 0.61: IC1.3 C9.+ | IC2.1 C2.1
  Bottom 0.813: JP18.4 8.89,90.49 9.84,91.44 v16.83,91.44 | v25.72,83.19 25.4,82.87 25.4,74.93 25.4,49.53 32.38,42.55 52.7,42.55 55.88,45.72 55.88,48.9 56.52,49.53 IC1.3
  Bottom 1.27: IC2.1 59.05,36.83 59.05,45.09 IC1.3 78.11,49.53 CON6A2.1 CON6A2.2 CON6A2.3 79.38,41.91 CON6A2.4 CON6A2.5 CON6A2.6
DB0
  Bottom 0.406: JP17.7 128.27,67.31 124.46,63.5 JP12.8
DB1
  Bottom 0.305: 129.54,91.44 129.54,93.71
  Bottom 0.406: 129.54,93.71 JP17.8 | JP12.7 127,63.5 129.54,66.04 129.54,91.44
DB2
  Bottom 0.406: JP12.6 129.54,63.5 130.81,64.77 130.81,67.31 JP17.9
DB3
  Bottom 0.305: 132.08,91.44 132.08,93.71
  Bottom 0.406: 132.08,93.71 JP17.10 | JP12.5 132.08,63.5 132.08,66.04 132.08,91.44
DB4
  Bottom 0.406: JP12.4 134.62,63.5 133.35,64.77 JP17.11
DB5
  Bottom 0.305: 134.62,91.44 134.62,93.71
  Bottom 0.406: 134.62,93.71 JP17.12 | JP12.3 137.16,63.5 134.62,66.04 134.62,91.44
DB6
  Bottom 0.406: JP12.2 139.7,63.5 135.89,67.31 JP17.13
DB7
  Bottom 0.305: 137.16,91.44 137.16,93.71
  Bottom 0.406: 137.16,93.71 JP17.14 | JP12.1 142.24,63.5 137.16,68.58 137.16,91.44
E
  Bottom 0.305: 127,91.44 127,93.71
  Bottom 0.406: 127,93.71 JP17.6 | JP12.9 121.92,63.5 127,68.58 127,91.44
N$1
  Bottom 0.406: R5.1 151.76,40.32 LED3.A
N$2
  Bottom 0.406: R3.1 151.76,37.78 LED2.A
N$3
  Bottom 0.406: R2.1 149.54,33.02 LED1.A
N$4
  Bottom 0.406: R6.1 150.81,45.09 LED4.A
N$5
  Bottom 0.406: JP2.2 R3.2
N$6
  Bottom 0.406: JP2.3 R5.2
N$7
  Bottom 0.406: JP2.1 R2.2
N$8
  Bottom 0.406: JP2.4 R6.2
N$9
  Bottom 0.406: R17.1 83.19,44.13 LED9.A
N$10
  Bottom 0.406: S1.1 130.38,7.62 126.36,7.62 123.19,10.79 JP5.9 R7.2
N$11
  Bottom 0.406: S2.1 122.63,15.16 121.92,15.88 | R8.2 JP5.7
  Bottom 0.61: JP5.7 121.92,15.88
N$12
  Bottom 0.406: S4.1 132.99,15.6 130.81,17.78 123.19,17.78 122.56,18.41 JP5.6 R14.2
N$13
  Bottom 0.406: 104.14,6.99 R20.E | R19.E 99.06,6.99 104.14,6.99 | JP3.8 86.36,33.66 87.63,34.92 88.58,34.92 R29.2 89.22,34.92 90.81,34.92 91.12,34.6 R30.2 91.76,34.92 93.34,34.92 93.67,34.6 R22.2 94.3,34.92 95.89,34.92 96.2,34.6 R25.2 96.84,34.92 102.87,34.92 107.31,30.48 107.31,8.26 106.05,6.99 104.14,6.99
N$14
  Bottom 0.406: JP6.3 77.16,85.72 R10.2
N$15
  Bottom 0.406: JP3.1 104.14,25.4 BUZ.+
N$16
  Bottom 0.406: SW2.8 JP3.7 R29.1
N$17
  Bottom 0.406: JP6.2 81.92,90.48 R11.2 84.14,90.81 R16.2
N$18
  Bottom 0.406: R18.1 81.92,15.88 LED10.A
N$19
  Bottom 0.406: S6.1 122.12,8.26 JP5.10 R21.2
N$20
  Bottom 0.406: S7.1 123.55,23.5 JP5.4 R23.2
N$21
  Bottom 0.406: LED11.A 84.78,88.27 R16.1
N$22
  Bottom 0.406: SW2.7 JP3.6 R30.1
N$23
  Bottom 0.406: SW2.6 JP3.5 R22.1
N$24
  Bottom 0.406: SW2.5 JP3.4 R25.1
N$25
  Bottom 0.406: S8.1 136.73,29.21 131.44,29.21 130.81,28.57 JP5.2 R24.2
N$26
  Bottom 0.406: 142.88,22.86 142.32,23.42 142.24,23.5 139.34,23.5 S3.3 134.9,27.94 132.72,27.94 132.51,27.94 S7.3 | 142.88,22.86 142.88,17.42 S5.3 142.67,12.7 | 142.67,12.7 142.67,7.47 S9.3 143.31,3.17 142.88,3.17 139.34,3.17 S1.3 135.69,3.17 135.25,3.17 131.72,3.17 S6.3 | 142.88,22.86 142.88,23.06 S8.3 142.88,27.58 142.88,27.94 142.88,32.38 141.6,33.66 123.83,33.66 JP5.1 | S2.3 131.72,13.34 135.69,13.34 135.79,13.44 S4.3 139.34,13.34 142.24,13.34 142.67,12.9 142.67,12.7
N$30
  Bottom 0.305: JP29.1 14.61,43.18 15.88,44.45 20.32,44.45 JP28.29
N$31
  Bottom 0.305: JP29.3 14.61,40.64 15.88,41.91 20.32,41.91 JP28.27
N$32
  Bottom 0.305: JP29.5 14.61,38.1 15.88,39.37 20.32,39.37 JP28.25
N$33
  Bottom 0.305: JP29.7 14.61,35.56 15.88,36.83 20.32,36.83 JP28.23
N$34
  Bottom 0.305: JP29.9 14.61,33.02 15.88,34.29 20.32,34.29 JP28.21
N$35
  Bottom 0.305: JP29.11 14.61,30.48 15.88,31.75 20.32,31.75 JP28.19
N$36
  Bottom 0.305: JP29.13 14.61,27.94 15.88,29.21 20.32,29.21 JP28.17
N$37
  Bottom 0.305: JP29.15 14.61,25.4 15.88,26.67 20.32,26.67 JP28.15
N$38
  Bottom 0.305: JP29.17 14.61,22.86 15.88,24.13 20.32,24.13 JP28.13
N$39
  Bottom 0.305: JP29.19 14.61,20.32 15.88,21.59 20.32,21.59 JP28.11
N$40
  Bottom 0.305: JP29.21 14.61,17.78 15.88,19.05 20.32,19.05 JP28.9
N$41
  Bottom 0.305: JP29.23 14.61,15.24 15.88,16.51 20.32,16.51 JP28.7
N$42
  Bottom 0.305: JP28.5 20.32,13.97 15.88,13.97 14.61,12.7 JP29.25
N$43
  Bottom 0.305: JP28.3 20.32,11.43 15.88,11.43 14.61,10.16 JP29.27
N$44
  Bottom 0.406: S9.1 138,7.62 132.72,7.62 131.44,8.89 129.54,8.89 127.64,10.79 127.64,12.06 126.36,13.34 JP5.8 R32.2
N$45
  Bottom 1.27: J1.PWR 33.92,87.27 39.05,92.39 | 39.05,92.39 39.37,92.71 JP4.1 | S10.2 S10.3 46.4,92.11 44.45,90.17 41.27,90.17 39.05,92.39
N$46
  Bottom 0.305: JP28.30 15.88,43.18 14.61,41.91 10.16,41.91 JP29.2
N$47
  Bottom 0.305: JP28.28 15.88,40.64 14.61,39.37 10.16,39.37 JP29.4
N$48
  Bottom 0.305: JP28.26 15.88,38.1 14.61,36.83 10.16,36.83 JP29.6
N$49
  Bottom 0.305: JP28.24 15.88,35.56 14.61,34.29 10.16,34.29 JP29.8
N$50
  Bottom 1.27: U$6.7 95.89,91.4 X2.2
N$51
  Bottom 0.406: R9.2 JP5.3 123.19,26.04 124.46,27.3 126.36,27.3 127.64,26.04 127.64,24.77 128.91,23.5 131.17,23.5 S3.1
N$52
  Bottom 1.27: U$6.5 100.97,91.4 X2.1
N$53
  Bottom 0.406: JP3.2 101.6,12.06 R20.S
N$54
  Bottom 0.406: R19.S 96.52,9.53 99.06,12.06 JP3.3
N$56
  Bottom 0.406: R33.1 JP7.3 93.34,71.75 U$6.1
N$58
  Bottom 0.406: R4.1 151.76,52.39 LED6.A
N$59
  Bottom 0.406: R1.1 150.81,47.62 LED5.A
N$60
  Bottom 0.406: R12.1 151.76,54.93 LED7.A
N$61
  Bottom 0.406: R13.1 149.54,59.69 LED8.A
N$62
  Bottom 0.406: JP2.6 R4.2
N$63
  Bottom 0.406: JP2.7 R12.2
N$64
  Bottom 0.406: JP2.5 R1.2
N$65
  Bottom 0.406: JP2.8 R13.2
N$66
  Bottom 0.406: S5.1 140.61,15.6 137.16,19.05 124.46,19.05 122.56,20.95 JP5.5 R15.2
N$67
  Bottom 0.406: U$6.2 95.89,71.75 JP7.2
N$71
  Bottom 0.305: JP29.29 14.61,7.62 15.88,8.89 20.32,8.89 JP28.1
N$72
  Bottom 0.305: JP29.30 10.16,6.35 14.61,6.35 15.88,7.62 JP28.2
N$73
  Bottom 0.406: U$6.4 100.97,71.75 JP7.1
N$75
  Bottom 0.406: U$6.8 93.34,76.2 91.44,74.3 91.44,71.12 JP7.4 R34.1
N$82
  Bottom 0.305: JP28.22 15.88,33.02 14.61,31.75 10.16,31.75 JP29.10
N$85
  Bottom 0.305: JP28.20 15.88,30.48 14.61,29.21 10.16,29.21 JP29.12
N$86
  Bottom 0.305: JP28.18 15.88,27.94 14.61,26.67 10.16,26.67 JP29.14
N$87
  Bottom 0.305: JP28.16 15.88,25.4 14.61,24.13 10.16,24.13 JP29.16
N$88
  Bottom 0.305: JP28.14 15.88,22.86 14.61,21.59 10.16,21.59 JP29.18
N$89
  Bottom 0.305: JP28.12 15.88,20.32 14.61,19.05 10.16,19.05 JP29.20
N$90
  Bottom 0.305: JP28.10 15.88,17.78 14.61,16.51 10.16,16.51 JP29.22
N$91
  Bottom 0.305: JP28.8 15.88,15.24 14.61,13.97 10.16,13.97 JP29.24
N$92
  Bottom 0.305: JP28.6 15.88,12.7 14.61,11.43 10.16,11.43 JP29.26
N$93
  Bottom 0.305: JP28.4 15.88,10.16 14.61,8.89 10.16,8.89 JP29.28
N$96
  Bottom 0.305: JP24.30 14.61,81.28 15.88,82.55 20.32,82.55 JP25.2
N$97
  Bottom 0.305: JP24.28 14.61,78.74 15.88,80.01 20.32,80.01 JP25.4
N$98
  Bottom 0.305: JP24.26 14.61,76.2 15.88,77.47 20.32,77.47 JP25.6
N$99
  Bottom 0.305: JP24.24 14.61,73.66 15.88,74.93 20.32,74.93 JP25.8
N$100
  Bottom 0.305: JP24.22 14.61,71.12 15.88,72.39 20.32,72.39 JP25.10
N$101
  Bottom 0.305: JP24.20 14.61,68.58 15.88,69.85 20.32,69.85 JP25.12
N$102
  Bottom 0.305: JP24.18 14.61,66.04 15.88,67.31 20.32,67.31 JP25.14
N$103
  Bottom 0.305: JP24.16 14.61,63.5 15.88,64.77 20.32,64.77 JP25.16
N$104
  Bottom 0.305: JP24.14 14.61,60.96 15.88,62.23 20.32,62.23 JP25.18
N$105
  Bottom 0.305: JP24.12 14.61,58.42 15.88,59.69 20.32,59.69 JP25.20
N$106
  Bottom 0.305: JP24.10 14.61,55.88 15.88,57.15 20.32,57.15 JP25.22
N$107
  Bottom 0.305: JP24.8 14.61,53.34 15.88,54.61 20.32,54.61 JP25.24
N$108
  Bottom 0.305: JP24.6 14.61,50.8 15.88,52.07 20.32,52.07 JP25.26
N$109
  Bottom 0.305: JP24.4 14.61,48.26 15.88,49.53 20.32,49.53 JP25.28
N$110
  Bottom 0.305: JP24.2 14.61,45.72 15.88,46.99 20.32,46.99 JP25.30
N$112
  Bottom 0.305: JP25.1 15.88,81.28 14.61,80.01 10.16,80.01 JP24.29
N$113
  Bottom 0.305: JP25.3 15.88,78.74 14.61,77.47 10.16,77.47 JP24.27
N$114
  Bottom 0.305: JP25.5 15.88,76.2 14.61,74.93 10.16,74.93 JP24.25
N$115
  Bottom 0.305: JP25.7 15.88,73.66 14.61,72.39 10.16,72.39 JP24.23
N$116
  Bottom 0.305: JP25.9 15.88,71.12 14.61,69.85 10.16,69.85 JP24.21
N$117
  Bottom 0.305: JP25.11 15.88,68.58 14.61,67.31 10.16,67.31 JP24.19
N$118
  Bottom 0.305: JP25.13 15.88,66.04 14.61,64.77 10.16,64.77 JP24.17
N$119
  Bottom 0.305: JP25.15 15.88,63.5 14.61,62.23 10.16,62.23 JP24.15
N$120
  Bottom 0.305: JP25.17 15.88,60.96 14.61,59.69 10.16,59.69 JP24.13
N$121
  Bottom 0.305: JP25.19 15.88,58.42 14.61,57.15 10.16,57.15 JP24.11
N$122
  Bottom 0.305: JP25.21 15.88,55.88 14.61,54.61 10.16,54.61 JP24.9
N$123
  Bottom 0.305: JP25.23 15.88,53.34 14.61,52.07 10.16,52.07 JP24.7
N$124
  Bottom 0.305: JP25.25 15.88,50.8 14.61,49.53 10.16,49.53 JP24.5
N$125
  Bottom 0.305: JP25.27 15.88,48.26 14.61,46.99 10.16,46.99 JP24.3
N$126
  Bottom 0.305: JP25.29 15.88,45.72 14.61,44.45 10.16,44.45 JP24.1
RS
  Bottom 0.305: 124.46,91.44 124.46,93.71
  Bottom 0.406: 124.46,93.71 JP17.4 | JP12.11 116.84,63.5 124.46,71.12 124.46,91.44
RW
  Bottom 0.406: JP17.5 125.73,69.85 119.38,63.5 JP12.10
V+
  Bottom 0.813: C8.1 59.05,57.15 IC1.1
  Bottom 1.27: IC1.1 70.48,54.61 CON6A1.6 CON6A1.5 CON6A1.4 CON6A1.3 CON6A1.2 CON6A1.1 61.91,93.03 | S10.1 61.8,93.14 61.91,93.03 | 61.91,93.03 64.14,95.25 97.16,95.25 98.42,93.98 98.42,84.45 | 98.42,84.45 C1.1 | C1.1 U$6.6 | 98.42,84.45 C1.1
VO
  Bottom 0.406: R31.2 123.19,86.78 JP17.3
VSS
  pour Bottom (isolate 0.61): 1.27,98.42 156.84,98.42 156.84,1.27 1.27,1.27